# EasyEDA schematic drone.json

## Sheets
1 main_board_1: TITLE: Main board 1; REV: 1.0; Date: 2022-11-19; Sheet: 1/1; Company: 134RN3R
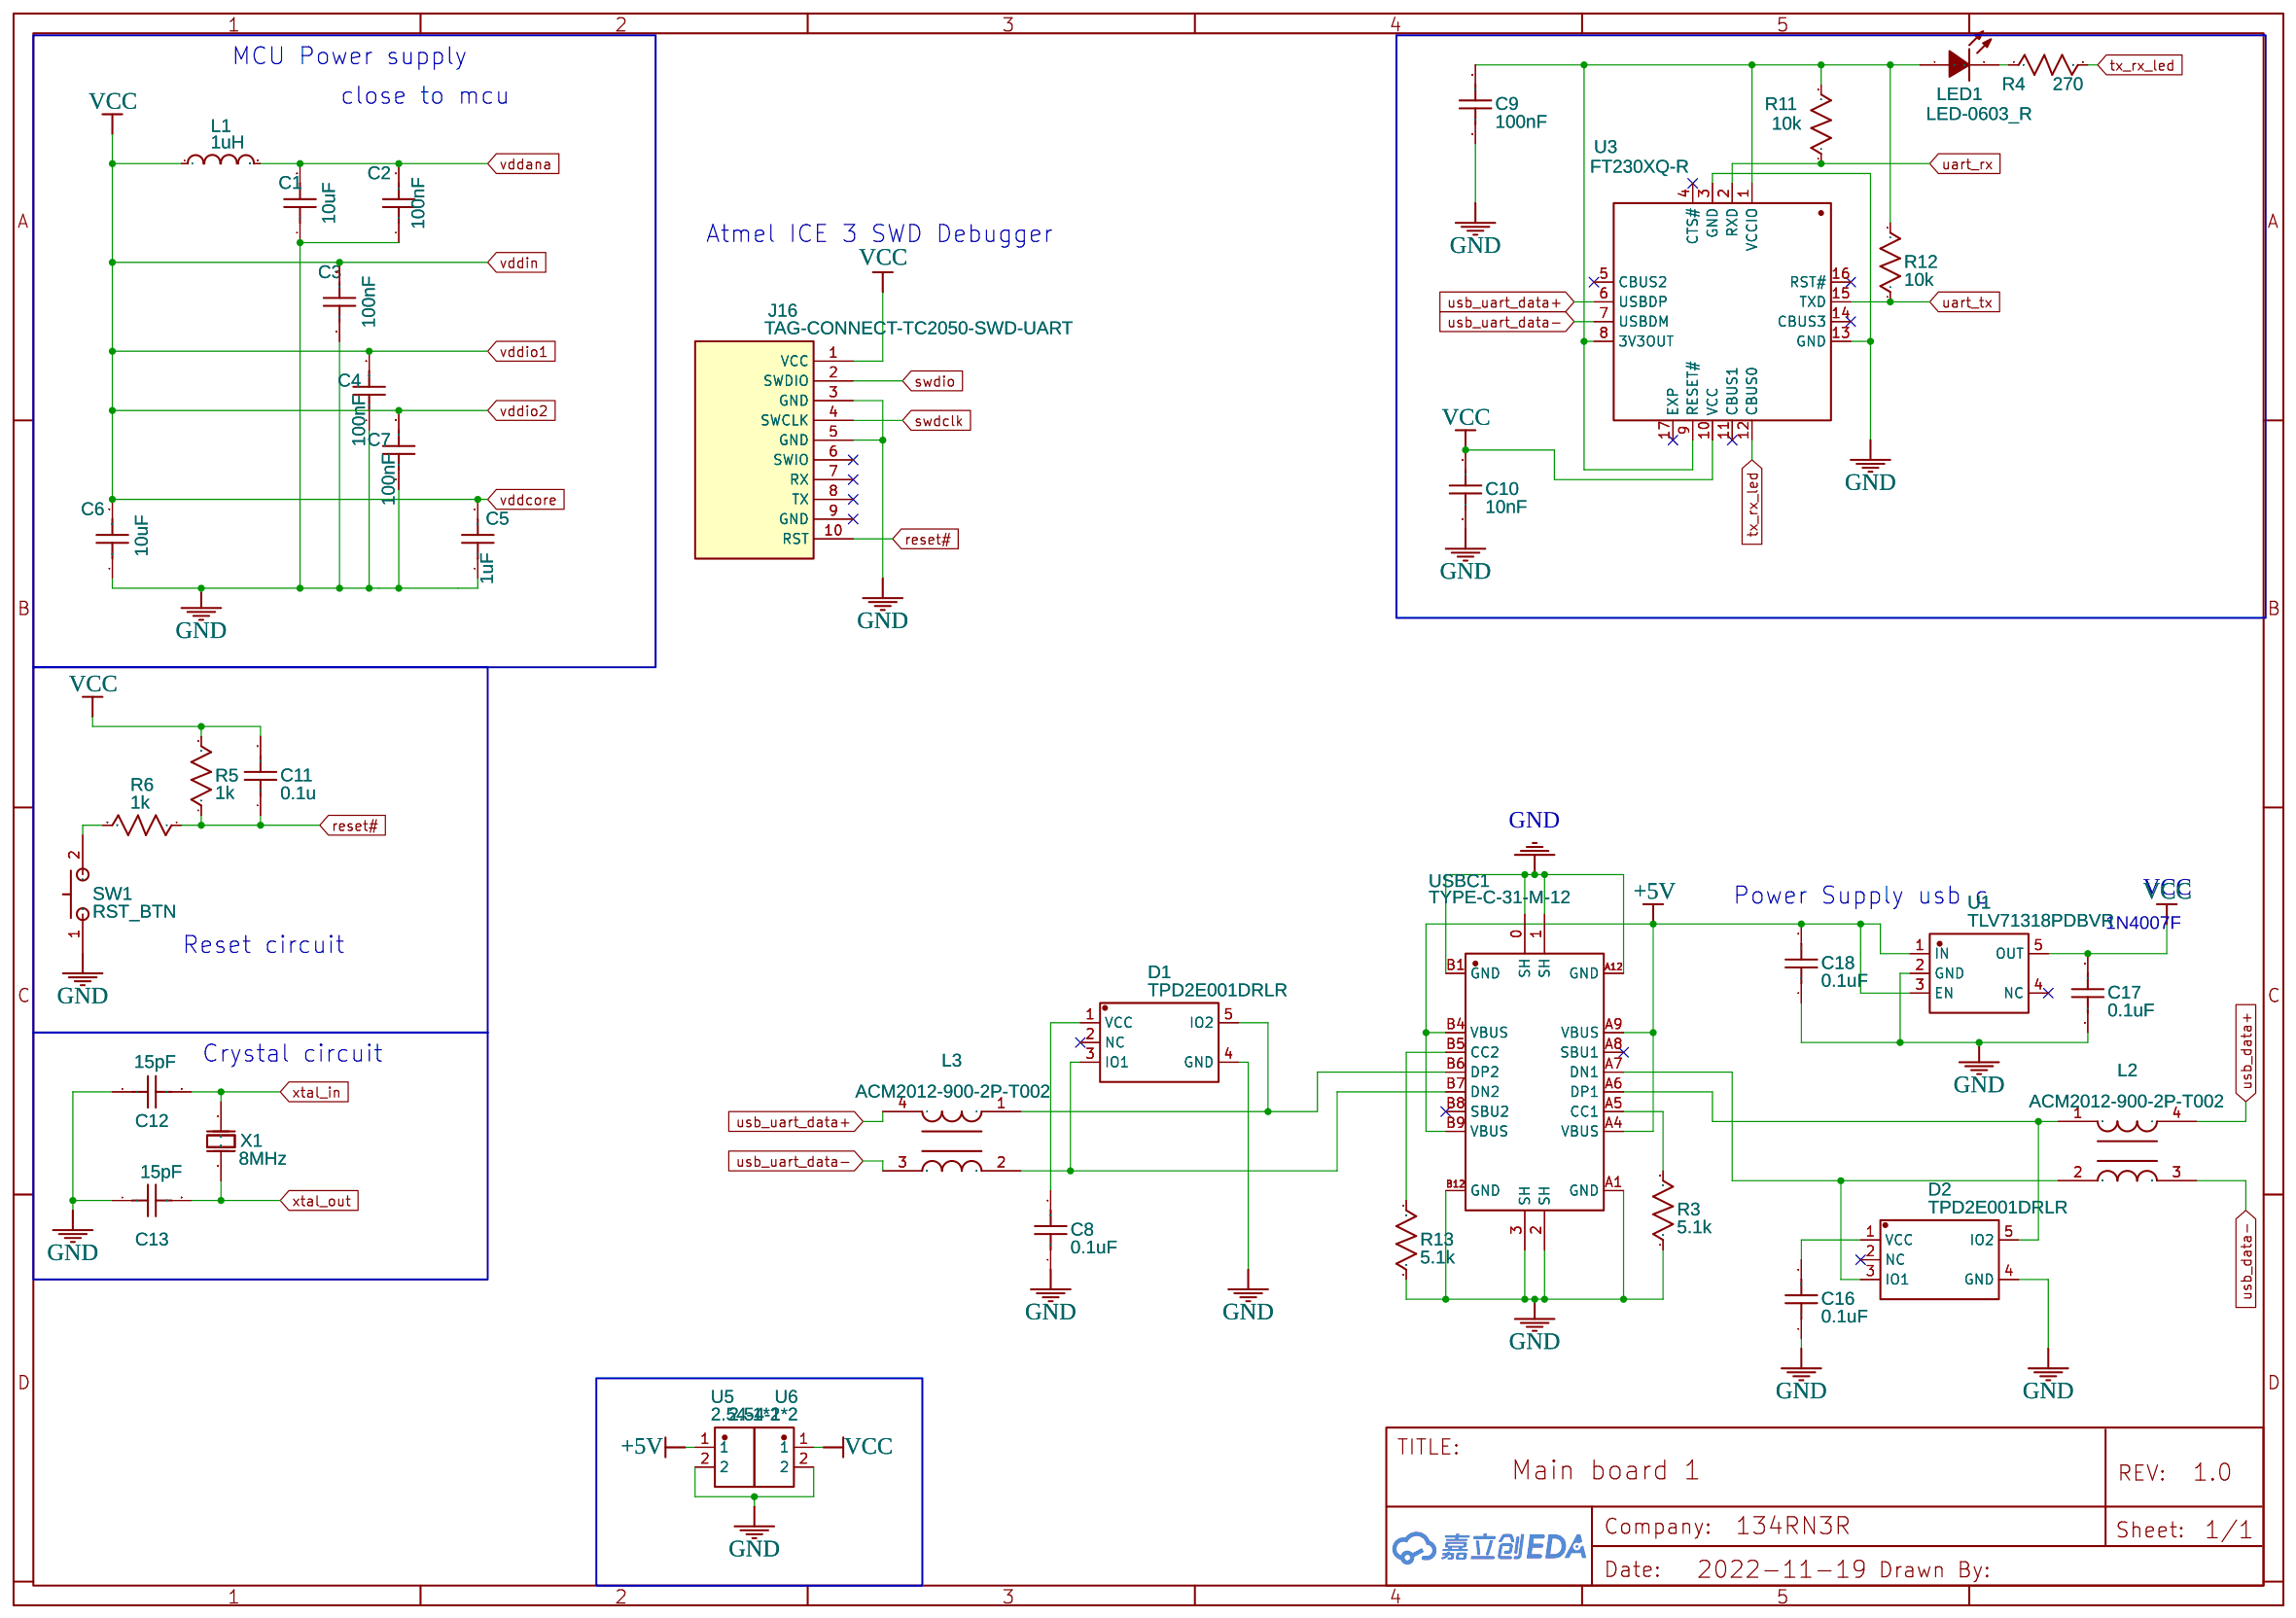
[diagram p0: main_board_1]
2 main_board_2: TITLE: Main board 2; Date: 2022-11-21; Drawn By: anischali
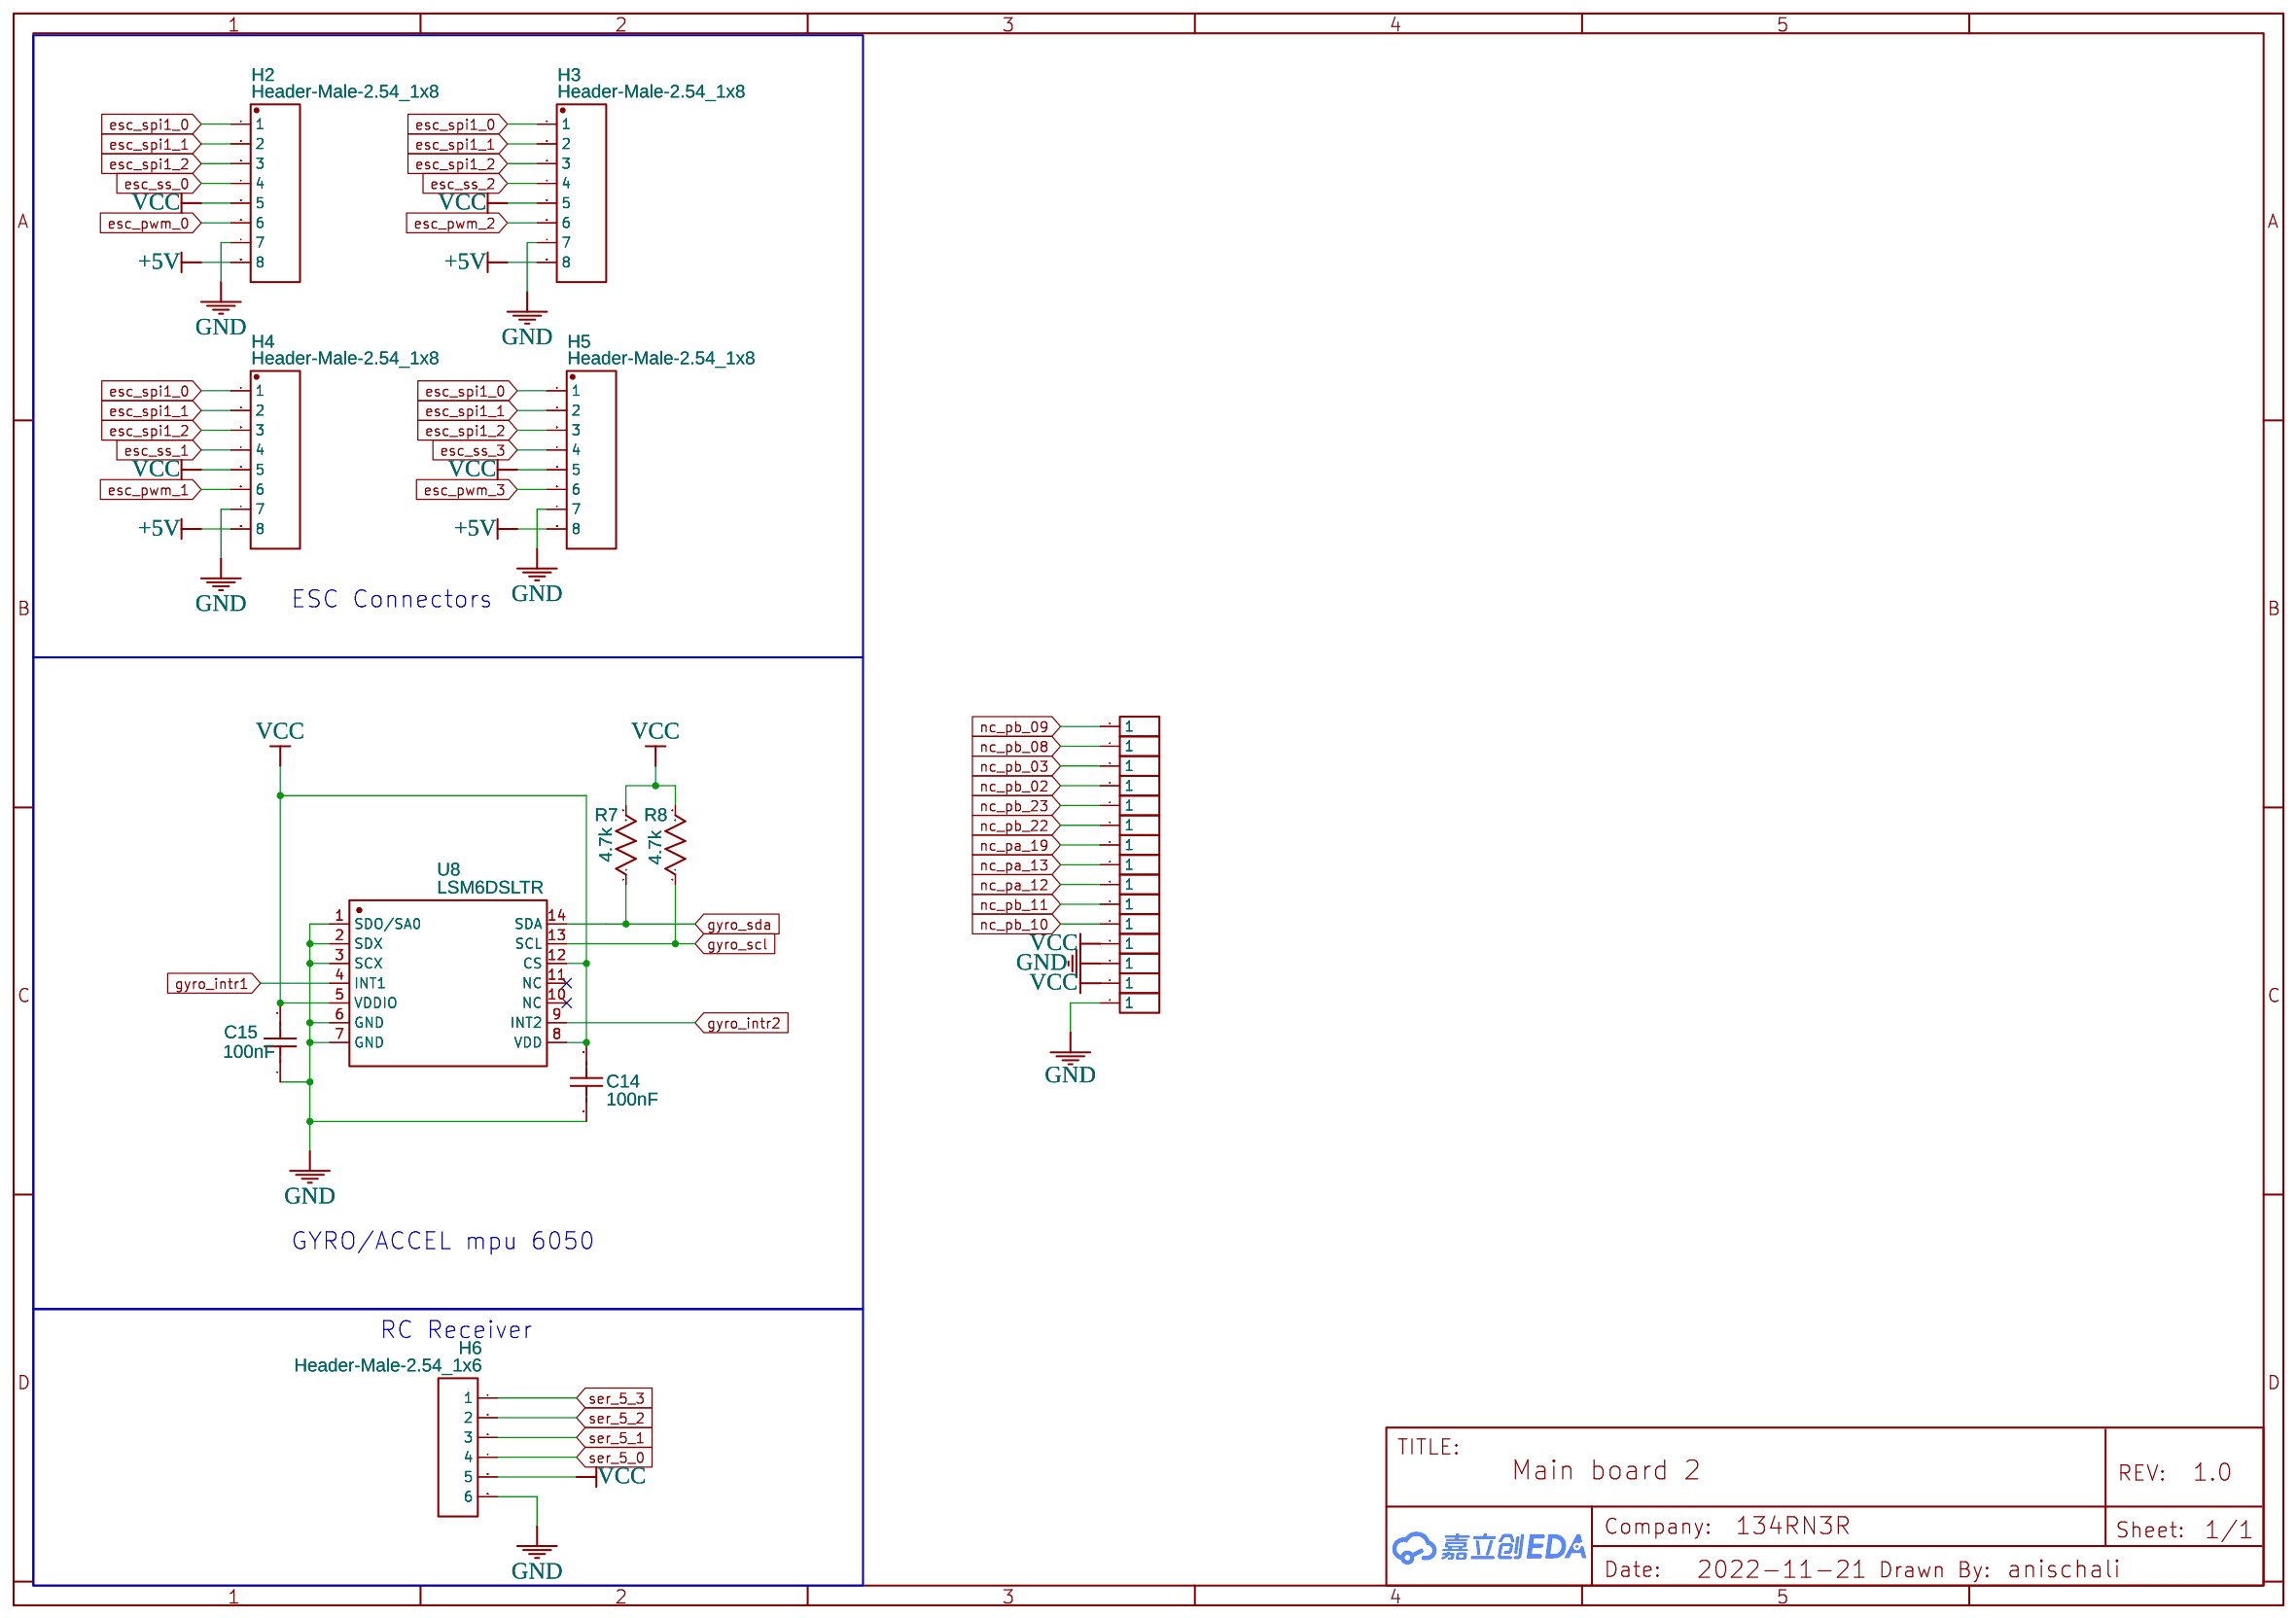
[diagram p1: main_board_2]
3 cpu: TITLE: Sheet_1; Date: 2023-01-31; Company: Your Company
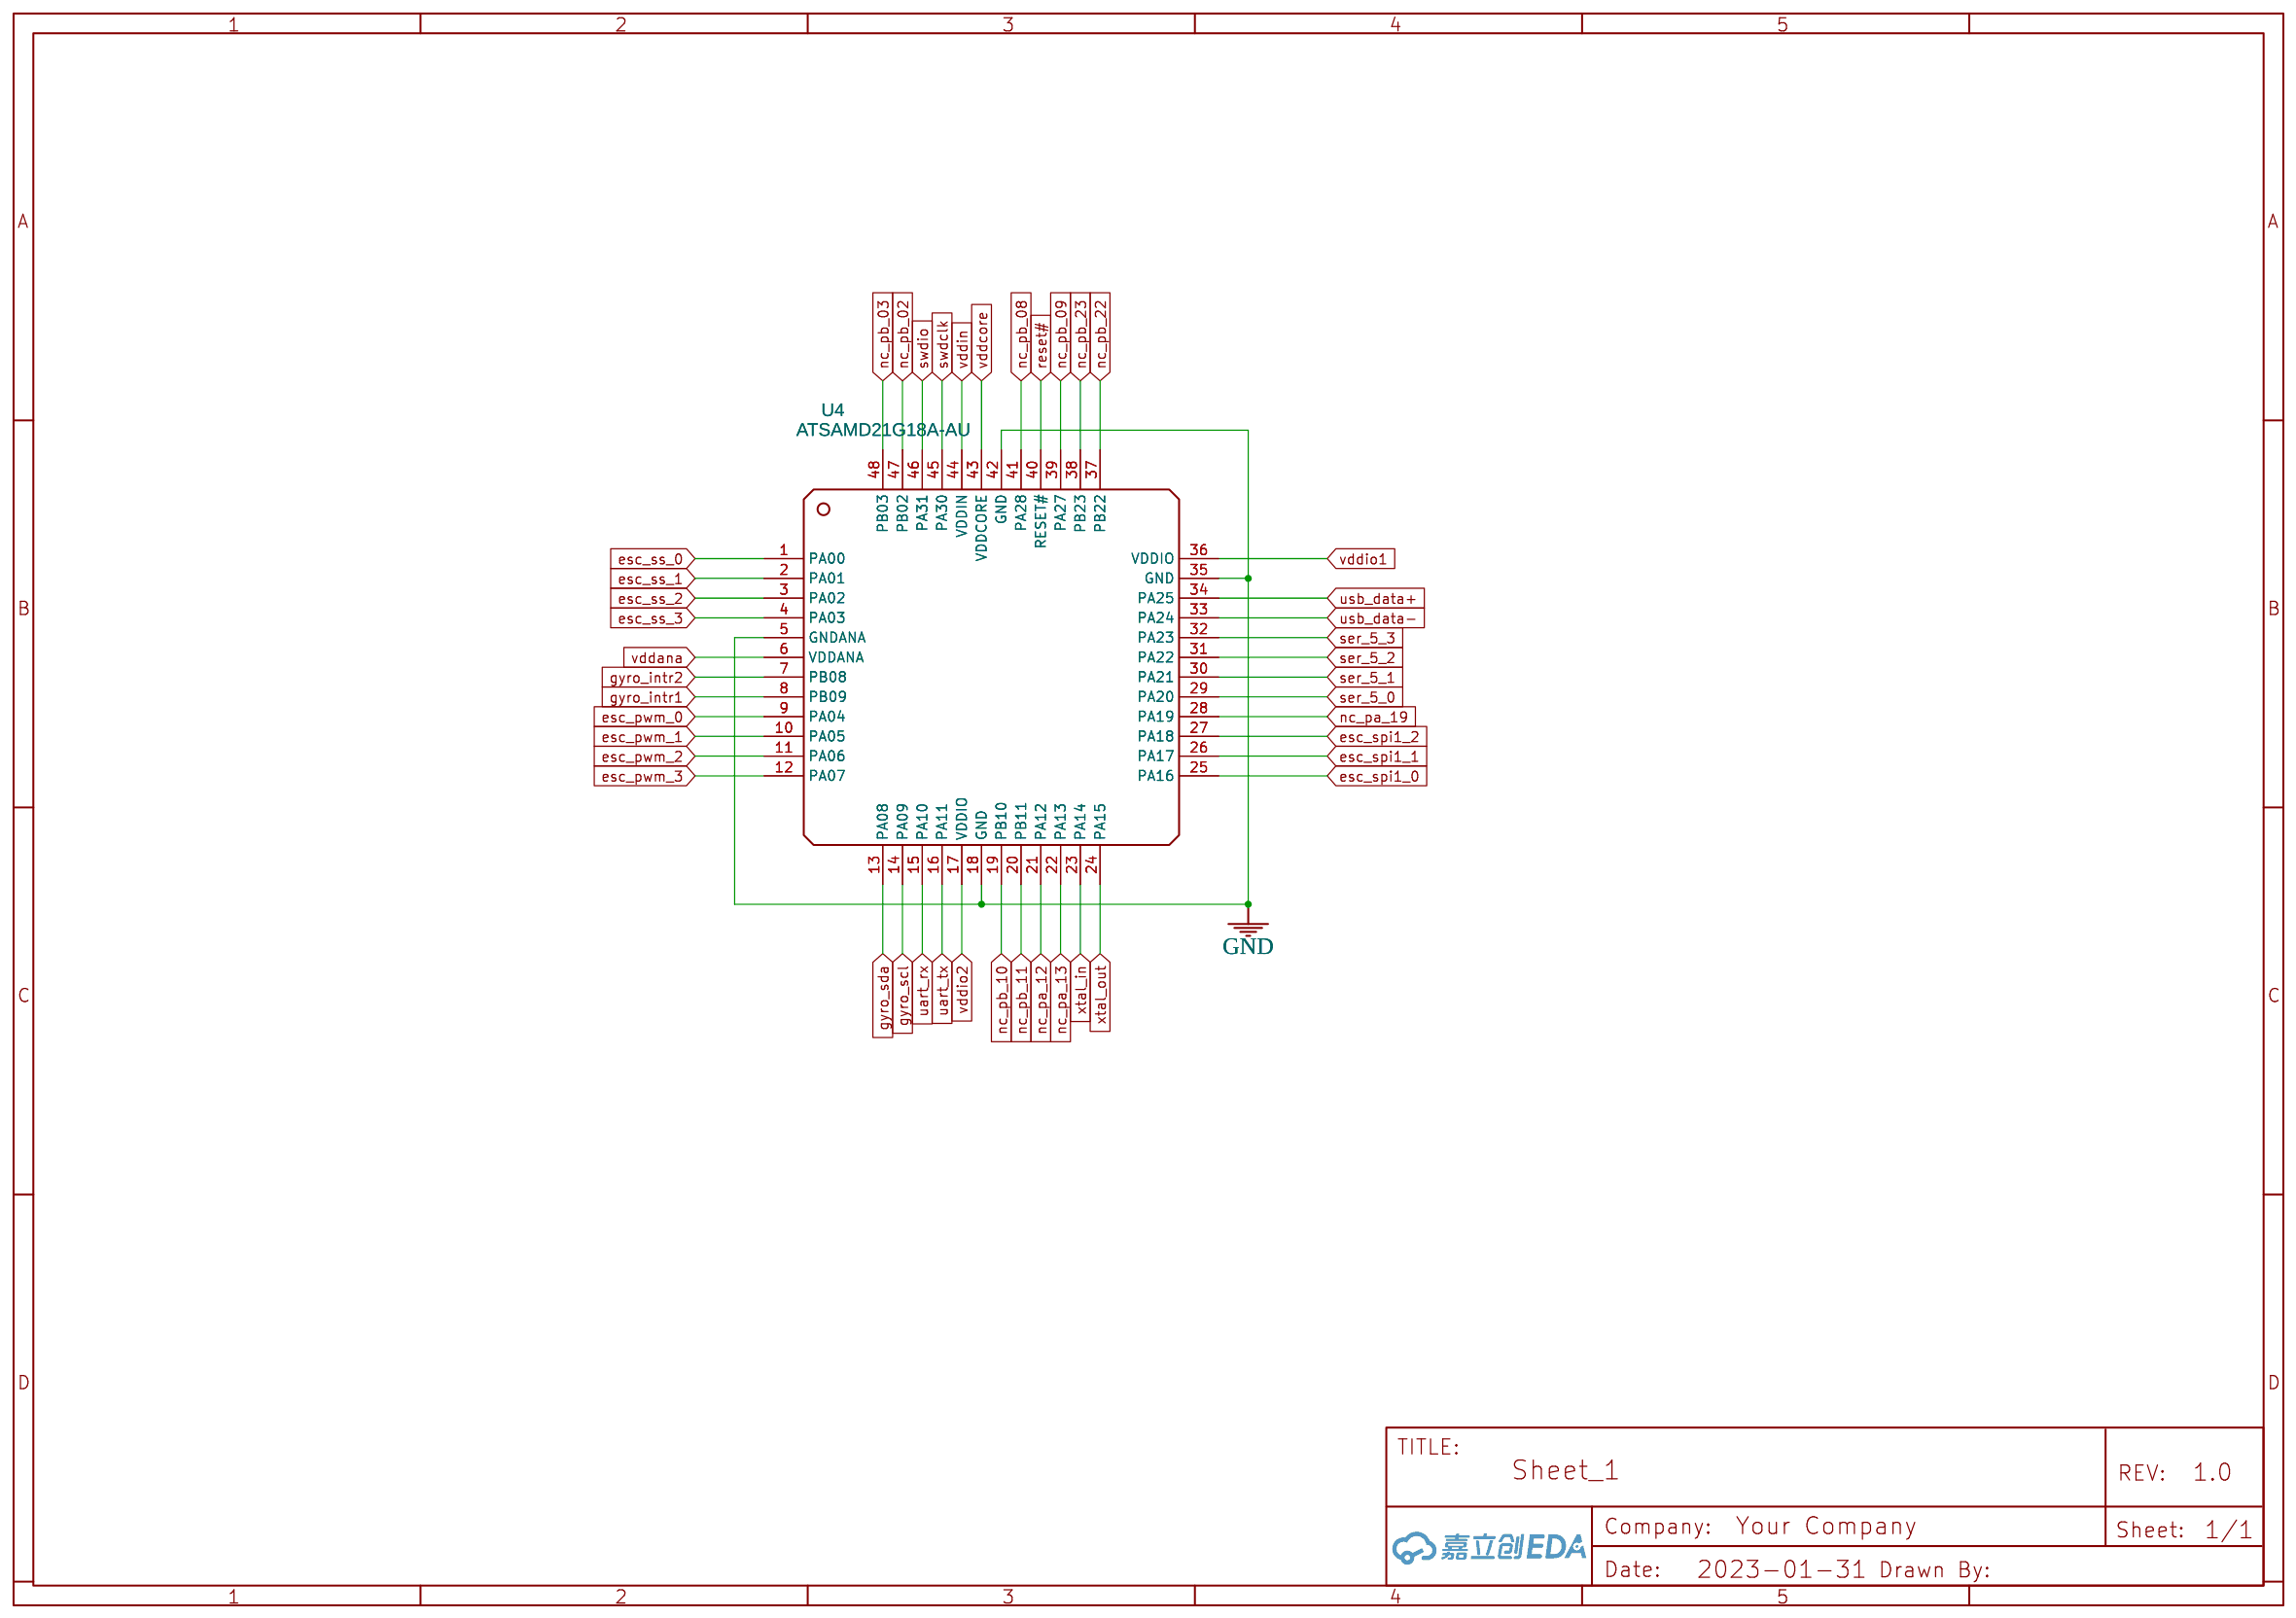
[diagram p2: cpu]

## Parts
sheet cpu
U4  ATSAMD21G18A-AU  [TQFP-48_L7.0-W7.0-P0.50-LS9.0-BL]
sheet main_board_1
C1  10uF  [C0603]
C2  100nF  [C0603]
C3  100nF  [C0603]
C4  100nF  [C0603]
C5  1uF  [C0603]
C6  10uF  [C0603]
C7  100nF  [C0603]
C8  0.1uF  [C0603]
C9  100nF  [C0603]
C10  10nF  [C0603]
C11  0.1u  [C0603]
C12  15pF  [C0603]
C13  15pF  [C0603]
C16  0.1uF  [C0603]
C17  0.1uF  [C0603]
C18  0.1uF  [C0603]
D1  TPD2E001DRLR  [SOT-553-5_L1.6-W1.2-P0.50-LS1.6-BR]
D2  TPD2E001DRLR  [SOT-553-5_L1.6-W1.2-P0.50-LS1.6-BR]
J16  TAG-CONNECT-TC2050-SWD-UART  [TC2050-IDC-FP]
L1  1uH  [L0603]
L2  ACM2012-900-2P-T002  [IND-SMD_4P-L2.0-W1.2-TL]
L3  ACM2012-900-2P-T002  [IND-SMD_4P-L2.0-W1.2-TL]
LED1  LED-0603_R  [LED0603_RED]
R3  5.1k  [R0603]
R4  270  [R0603]
R5  1k  [R0603]
R6  1k  [R0603]
R11  10k  [R0603]
R12  10k  [R0603]
R13  5.1k  [R0603]
SW1  RST_BTN  [SW-SMD_L3.9-W2.9-LS5.0]
U1  TLV71318PDBVR  [SOT-23-5_L3.0-W1.7-P0.95-LS2.8-BR]
U3  FT230XQ-R  [QFN-16_L4.0-W4.0-P0.65-BL-EP2.2]
U5  2.54-1*2  [HDR-TH_2P-P2.54-V-M]
U6  2.54-1*2  [HDR-TH_2P-P2.54-V-M]
USBC1  TYPE-C-31-M-12  [USB-C_SMD-TYPE-C-31-M-12]
X1  8MHz  [HC-49US_L11.5-W4.5-P4.88]
sheet main_board_2
C14  100nF  [C0603]
C15  100nF  [C0603]
H2  Header-Male-2.54_1x8  [HDR-TH_8P-P2.54-V-M]
H3  Header-Male-2.54_1x8  [HDR-TH_8P-P2.54-V-M]
H4  Header-Male-2.54_1x8  [HDR-TH_8P-P2.54-V-M]
H5  Header-Male-2.54_1x8  [HDR-TH_8P-P2.54-V-M]
H6  Header-Male-2.54_1x6  [HDR-TH_6P-P2.54-V-M-1]
J1  HDR-M-2.54_1x1  [HDR-M-2.54_1X1]
J2  HDR-M-2.54_1x1  [HDR-M-2.54_1X1]
J3  HDR-M-2.54_1x1  [HDR-M-2.54_1X1]
J4  HDR-M-2.54_1x1  [HDR-M-2.54_1X1]
J5  HDR-M-2.54_1x1  [HDR-M-2.54_1X1]
J6  HDR-M-2.54_1x1  [HDR-M-2.54_1X1]
J7  HDR-M-2.54_1x1  [HDR-M-2.54_1X1]
J8  HDR-M-2.54_1x1  [HDR-M-2.54_1X1]
J9  HDR-M-2.54_1x1  [HDR-M-2.54_1X1]
J10  HDR-M-2.54_1x1  [HDR-M-2.54_1X1]
J11  HDR-M-2.54_1x1  [HDR-M-2.54_1X1]
J12  HDR-M-2.54_1x1  [HDR-M-2.54_1X1]
J13  HDR-M-2.54_1x1  [HDR-M-2.54_1X1]
J14  HDR-M-2.54_1x1  [HDR-M-2.54_1X1]
J15  HDR-M-2.54_1x1  [HDR-M-2.54_1X1]
R7  4.7k  [R0603]
R8  4.7k  [R0603]
U8  LSM6DSLTR  [LGA-14_L3.0-W2.5-P0.50-TL]

## Library data of the parts
U4 = ATSAMD21G18A-AU: Supplier: LCSC; Manufacturer: MICROCHIP(美国微芯); Contributor: LCSC; Supplier Part: C78624; JLCPCB Part Class: Extended Part
C1-C18 = C_0603_US: Contributor: LCEDA_Lib
D1 D2 = TPD2E001DRLR: Supplier: LCSC; Supplier Part: C150526; Manufacturer: TI(德州仪器); Contributor: LCSC; JLCPCB Part Class: Extended Part
J16 = TAG-CONNECT-TC2050-SWD-UART: Altium JTAG Adapter Cable; Contributor: KrashIndustries_Stephane
L1 = L0603_US: Contributor: LCEDA_Lib
L2 L3 = ACM2012-900-2P-T002: Supplier: LCSC; Manufacturer: TDK; Supplier Part: C19972; JLCPCB Part Class: Extended Part
LED1 = LED-0603_R: Manufacturer: EVERLIGHT(台湾亿光); Manufacturer Part: 19-217/R6C-AL1M2VY/3T; Supplier Part: C72044; Supplier: LCSC; Contributor: LCEDA_01
R3-R8 R11-R13 = R_0603_US: Contributor: LCEDA_Lib
SW1 = SW_BUTTON_3X6_SM: Supplier: LCSC; Supplier Part: C9900004645; Manufacturer: null; Manufacturer Part: SW_BUTTON_3x6_SM; Contributor: LCSC; JLCPCB Part Class: Extended Part
U1 = TLV71318PDBVR: Supplier: LCSC; Supplier Part: C2869099; Manufacturer: TI(德州仪器); JLCPCB Part Class: Extended Part; Contributor: LCSC
U3 = FT230XQ-R: Supplier: LCSC; Manufacturer: FTDI(飞特帝亚); Contributor: LCSC; Supplier Part: C128629; JLCPCB Part Class: Extended Part
U5 U6 = 2.54-1*2: Supplier: LCSC; Supplier Part: C5116481; Manufacturer: ZHOURI(洲日); link: https://atta.szlcsc.com/upload/public/pdf/source/20220729/DF18AADA08AA3A4F1D3B0508BB8F7248.pdf; Contributor: lcsc; JLCPCB Part Class: Extended Part
USBC1 = TYPE-C-31-M-12: Supplier: LCSC; Supplier Part: C165948; Manufacturer: 韩国韩荣; Contributor: LCSC; JLCPCB Part Class: Extended Part
X1 = X49SD8MSB2SI: Supplier: LCSC; Supplier Part: C188205; Manufacturer: YXC(扬兴晶振); Contributor: LCSC; JLCPCB Part Class: Extended Part
H2-H5 = Header-Male-2.54_1x8: Supplier: LCSC; Manufacturer: Ckmtw; Manufacturer Part: 210S-1*8P L=11.6MMGold-plated black; Contributor: LCSC; Supplier Part: C124381; JLCPCB Part Class: Extended Part
H6 = Header-Male-2.54_1x6: Supplier: LCSC; Manufacturer: BOOMELE(博穆精密); Manufacturer Part: 2.54-1x6P直针; Supplier Part: C37208; JLCPCB Part Class: Extended Part
J1-J15 = HDR-M-2.54_1x1: Supplier Part: C81276; Supplier: LCSC; Contributor: LCEDA_Lib
U8 = LSM6DSLTR: Supplier: LCSC; Manufacturer: ST(意法半导体); Contributor: LCSC; Supplier Part: C126672; JLCPCB Part Class: Extended Part

## Nets
+5V: C18.2 H2.8 H3.8 H4.8 H5.8 U1.1(IN) U1.3(EN) U5.1 USBC1.A4(VBUS) USBC1.A9(VBUS) USBC1.B4(VBUS) USBC1.B9(VBUS)
GND: C1.1 C2.1 C3.1 C4.1 C5.1 C6.1 C7.1 C8.1 C9.1 C10.1 C12.1 C13.1 C14.1 C15.1 C16.1 C17.1 C18.1 D1.4(GND) D2.4(GND) H2.7 H3.7 H4.7 H5.7 H6.6 J13.1 J15.1 J16.3(GND) J16.5(GND) R3.1 R13.1 SW1.1 U1.2(GND) U3.3(GND) U3.13(GND) U4.5(GNDANA) U4.18(GND) U4.35(GND) U4.42(GND) U5.2 U6.2 U8.1(SDO/SA0) U8.2(SDX) U8.3(SCX) U8.6(GND) U8.7(GND) USBC1.0(SH) USBC1.1(SH) USBC1.2(SH) USBC1.3(SH) USBC1.A1(GND) USBC1.A12(GND) USBC1.B1(GND) USBC1.B12(GND)
VCC: C3.2 C4.2 C5.2 C6.2 C7.2 C10.2 C11.2 C14.2 C15.2 C17.2 H2.5 H3.5 H4.5 H5.5 H6.5 J12.1 J14.1 J16.1(VCC) L1.1 R5.2 R7.2 R8.2 U1.5(OUT) U3.10(VCC) U4.17(VDDIO) U4.36(VDDIO) U4.43(VDDCORE) U4.44(VDDIN) U6.1 U8.5(VDDIO) U8.8(VDD) U8.12(CS)
vddana: C1.2 C2.2 L1.2 U4.6(VDDANA)
esc_pwm_0: H2.6 U4.9(PA04)
esc_pwm_1: H4.6 U4.10(PA05)
esc_pwm_2: H3.6 U4.11(PA06)
esc_pwm_3: H5.6 U4.12(PA07)
esc_spi1_0: H2.1 H3.1 H4.1 H5.1 U4.25(PA16)
esc_spi1_1: H2.2 H3.2 H4.2 H5.2 U4.26(PA17)
esc_spi1_2: H2.3 H3.3 H4.3 H5.3 U4.27(PA18)
esc_ss_0: H2.4 U4.1(PA00)
esc_ss_1: H4.4 U4.2(PA01)
esc_ss_2: H3.4 U4.3(PA02)
esc_ss_3: H5.4 U4.4(PA03)
gyro_intr1: U4.8(PB09) U8.4(INT1)
gyro_intr2: U4.7(PB08) U8.9(INT2)
gyro_scl: R8.1 U4.14(PA09) U8.13(SCL)
gyro_sda: R7.1 U4.13(PA08) U8.14(SDA)
nc_pa_12: J9.1 U4.21(PA12)
nc_pa_13: J8.1 U4.22(PA13)
nc_pa_19: J7.1 U4.28(PA19)
nc_pb_02: J4.1 U4.47(PB02)
nc_pb_03: J3.1 U4.48(PB03)
nc_pb_08: J2.1 U4.41(PA28)
nc_pb_09: J1.1 U4.39(PA27)
nc_pb_10: J11.1 U4.19(PB10)
nc_pb_11: J10.1 U4.20(PB11)
nc_pb_22: J6.1 U4.37(PB22)
nc_pb_23: J5.1 U4.38(PB23)
reset#: C11.1 J16.10(RST) R5.1 R6.1 U4.40(RESET#)
ser_5_0: H6.4 U4.29(PA20)
ser_5_1: H6.3 U4.30(PA21)
ser_5_2: H6.2 U4.31(PA22)
ser_5_3: H6.1 U4.32(PA23)
swdclk: J16.4(SWCLK) U4.45(PA30)
swdio: J16.2(SWDIO) U4.46(PA31)
tx_rx_led: R4.2 U3.12(CBUS0)
uart_rx: R11.1 U3.2(RXD) U4.15(PA10)
uart_tx: R12.1 U3.15(TXD) U4.16(PA11)
usb_data+: L2.4 U4.34(PA25)
usb_data-: L2.3 U4.33(PA24)
usb_uart_data+: L3.4 U3.6(USBDP)
usb_uart_data-: L3.3 U3.7(USBDM)
xtal_in: C12.2 U4.23(PA14) X1.2(OSC2)
xtal_out: C13.2 U4.24(PA15) X1.1(OSC1)
Net-(C8-2): C8.2 D1.1(VCC)
Net-(C9-2): C9.2 LED1.1 R11.2 R12.2 U3.1(VCCIO) U3.8(3V3OUT) U3.9(RESET#)
Net-(C16-2): C16.2 D2.1(VCC)
Net-(D1-3): D1.3(IO1) L3.2 USBC1.B7(DN2)
Net-(D1-5): D1.5(IO2) L3.1 USBC1.B6(DP2)
Net-(D2-3): D2.3(IO1) L2.2 USBC1.A7(DN1)
Net-(D2-5): D2.5(IO2) L2.1 USBC1.A6(DP1)
Net-(LED1-2): LED1.2 R4.1
Net-(R3-2): R3.2 USBC1.A5(CC1)
Net-(R6-2): R6.2 SW1.2
Net-(R13-2): R13.2 USBC1.B5(CC2)

Not connected (* = marked no-connect by the designer): D1 2(NC)*; D2 2(NC)*; J16 6(SWIO)* 7(RX)* 8(TX)* 9(GND)*; U1 4(NC)*; U3 4(CTS#)* 5(CBUS2)* 11(CBUS1)* 14(CBUS3)* 16(RST#)* 17(EXP)*; U8 10(NC)* 11(NC)*; USBC1 A8(SBU1)* B8(SBU2)*

## Notes on the sheets
sheet 1
- MCU Power supply
- close to mcu
- Atmel ICE 3 SWD Debugger
- Power Supply usb c
- VCC
- Reset circuit
- 1N4007F
- Crystal circuit
sheet 2
- ESC Connectors
- GYRO/ACCEL mpu 6050
- RC Receiver
